# EAGLE board DAWA 6.3 (EAGLE 9.5.0)
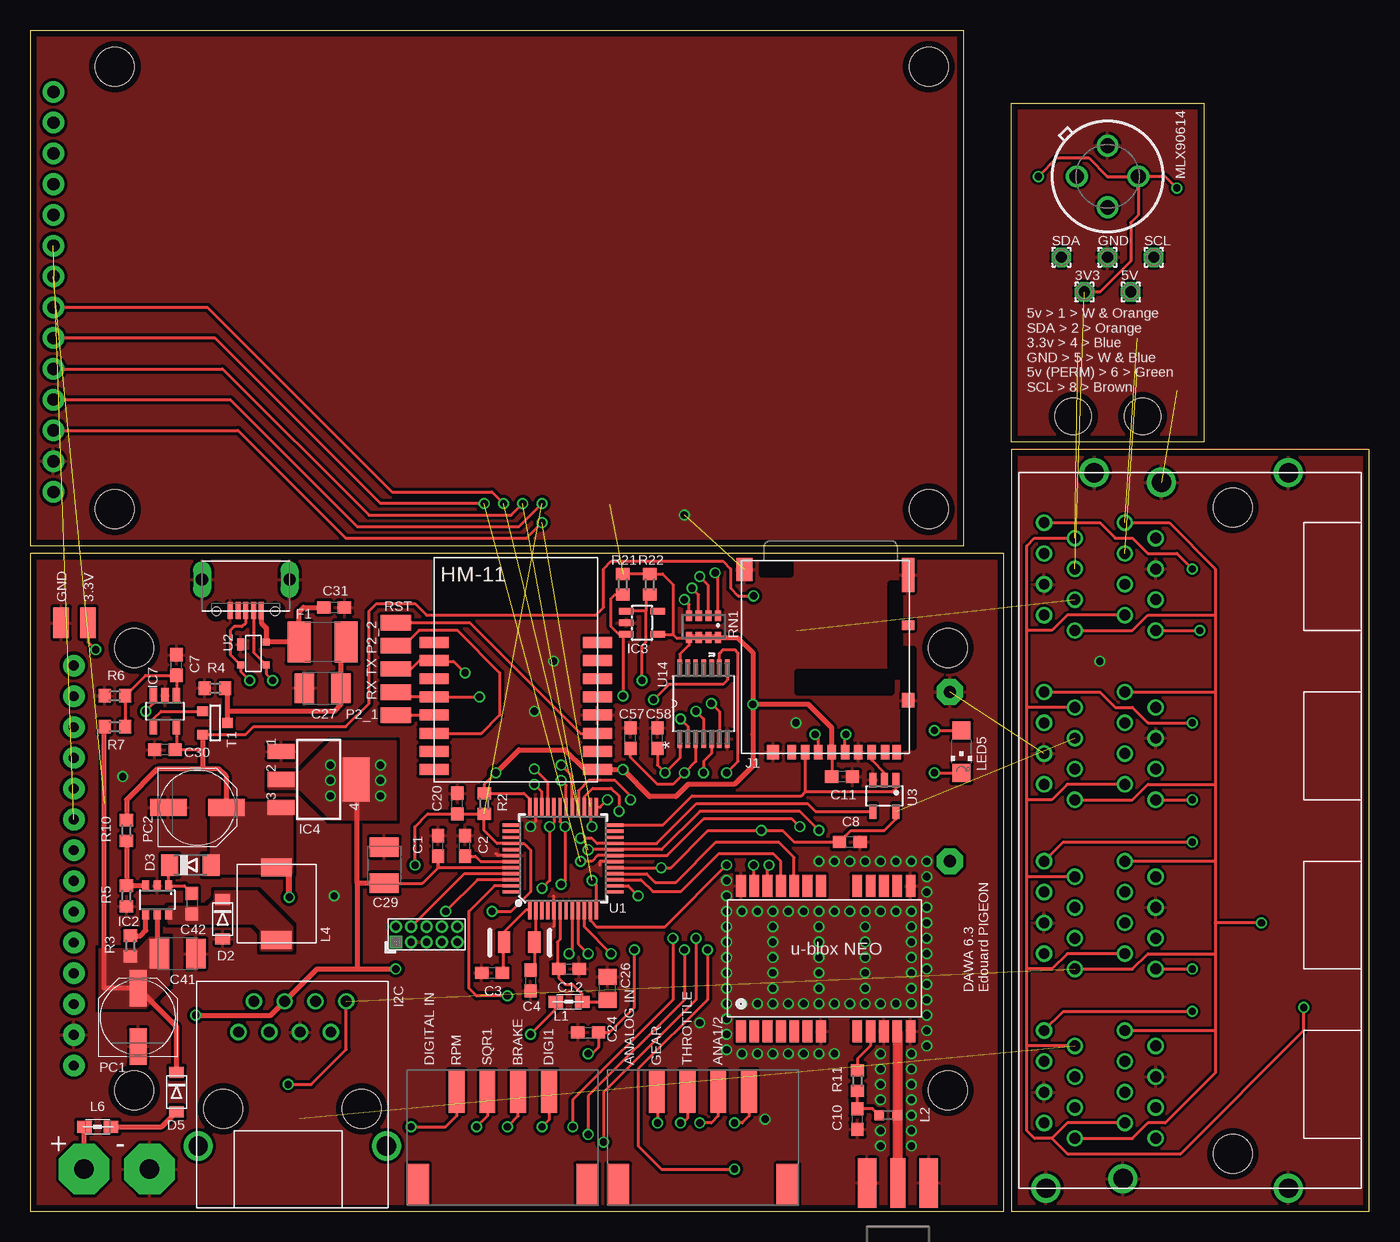
[diagram p3: board, top side]
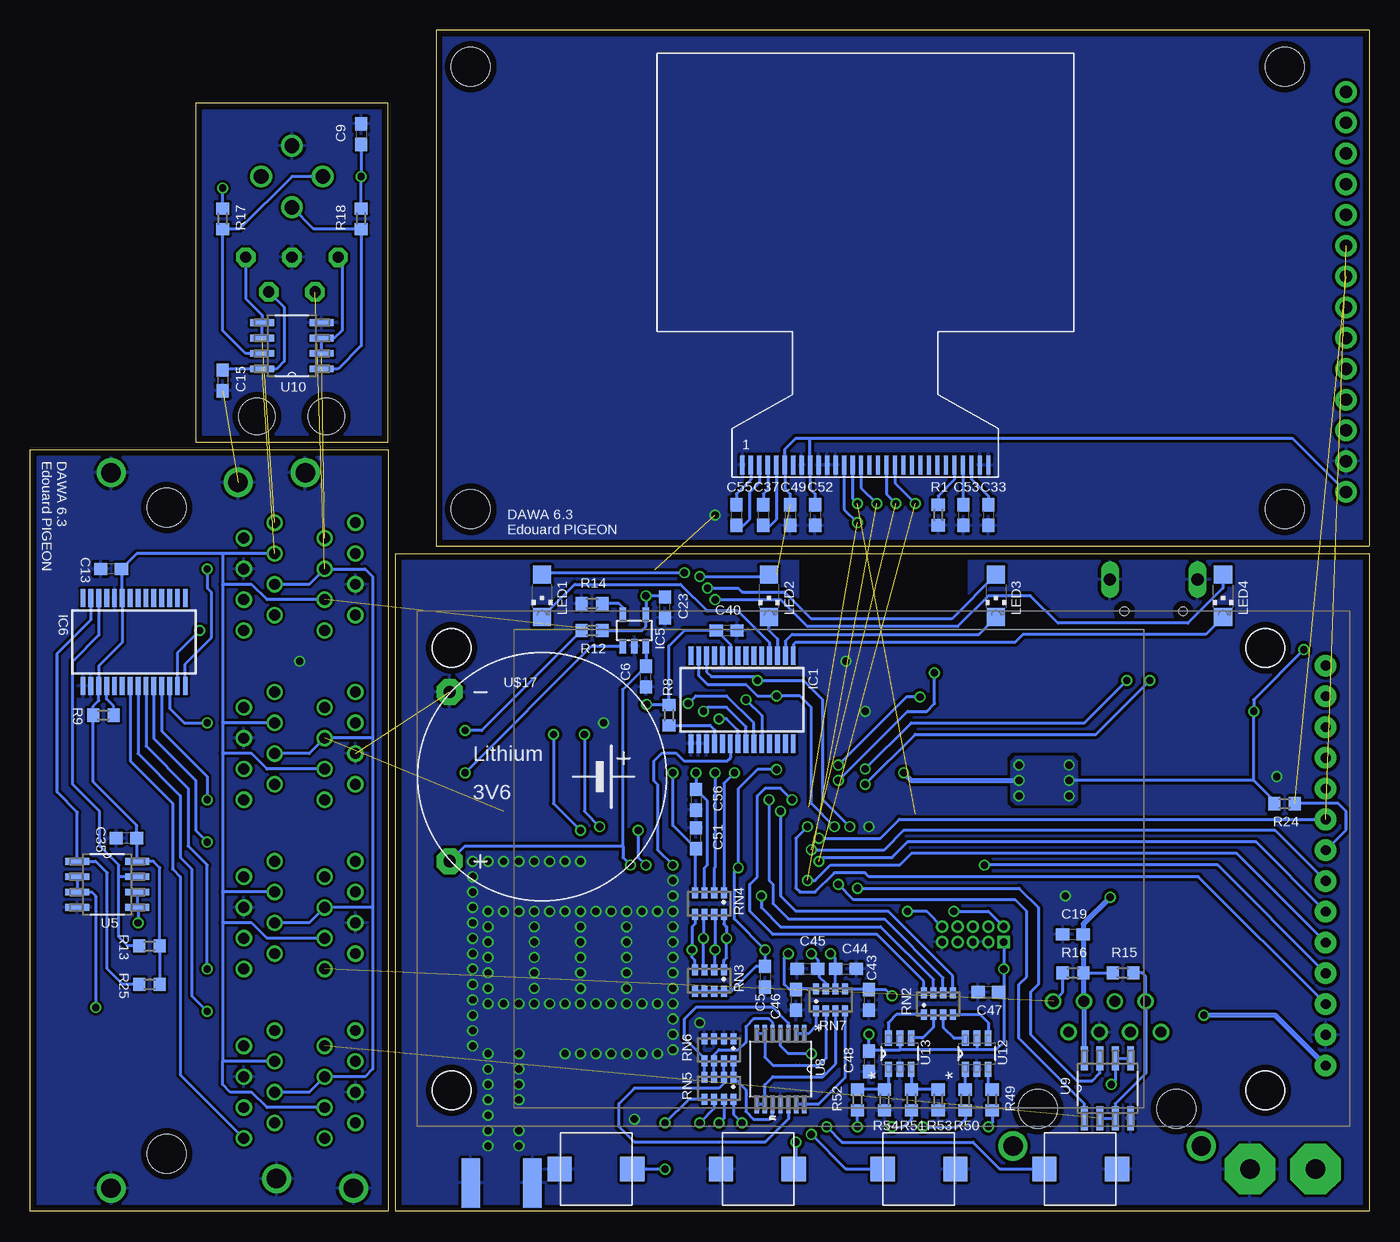
[diagram p4: board, bottom side, seen from below]

Size 110.49 x 97.47 mm. Coordinates in mm from the lower left corner, seen from the top.
Outline: 0.01,97.47 0.01,54.94
Outline: 0,97.47 76.99,97.47 76.99,54.93 0,54.93
Outline: 80.33,54.29 0.01,54.29 0.01,0.01 80.33,0.01 80.33,54.29
Outline: 80.96,91.44 96.84,91.44 96.84,63.5 80.96,63.5 80.96,91.44
Outline: 80.96,62.87 80.96,0 110.49,0 110.49,62.87 80.96,62.87
Copper layers (1*16): Top 0.035mm / dielectric 1.6mm / Bottom 0.035mm
Design rules "Elecrow_2-layer_PCB_eagle_rule *": minimum track width 6mil, minimum drill 12mil, track to track 6mil, track to pad 6mil, pad to pad 6mil, via to via 6mil, smd to smd 0mil, copper to edge 20mil, drill to drill 10mil, minimum pad ring 6mil, minimum via ring 6mil, stop-mask expansion 0mil, vias tented up to drill 100mil, thermal gap 10mil
Net classes: 0 default: width 0.203 mm, drill 0.406 mm, clearance 0.203 mm; 3 usbvcc: width 0.203 mm, drill 0.406 mm, clearance 0.203 mm; 4 USBpair: width 0.254 mm, drill 0.406 mm, clearance 0.61 mm
Holes 3 mm at 86.07,65.62 91.79,65.62
Holes 3.2 mm at 8.57,46.51 8.57,10 75.72,10 75.72,46.51 6.99,94.46 6.99,57.94 74.14,57.94 74.14,94.46

## Footprints (pad centres in the part's own frame; a part is rotated, then mirrored left to right if it is on the bottom)
SMD1,27-2,54 = smd 1.27 x 2.54: 1 0,0
4,16O1,6 = drill 1.6 pad 4.166 octagon: 1 0,0
C0603 = smd 1.1 x 1: 1 -0.85,0; 2 0.85,0
C0805 = smd 1.3 x 1.5: 1 -0.95,0; 2 0.95,0
SMC_B = smd 1.6 x 2.4: + -1.5,0; - 1.5,0
USB-MINIB-DAWA = smd 0.406 x 1.372: D+ 0,4.381; D- -0.641,4.381; GND 1.282,4.381; ID 0.641,4.381; VBUS -1.282,4.381 | drill 1 long: GND1 -3.612,1.826; GND2 3.612,1.826 | hole 0.7: -2.421,4.445; 2.421,4.445
SOD-123FL = smd 0.91 x 1.22: A 1.637,0; C -1.637,0
MINIMELF = smd 1.4 x 1.8: A 1.7,0; C -1.7,0
L1812 = smd 1.9 x 3.4: 1 -1.95,0; 2 1.95,0
SSOP28 = smd 0.4 x 1.5: 1 -4.225,-3.625; 2 -3.575,-3.625; 3 -2.925,-3.625; 4 -2.275,-3.625; 5 -1.625,-3.625; 6 -0.975,-3.625; 7 -0.325,-3.625; 8 0.325,-3.625; 9 0.975,-3.625; 10 1.625,-3.625; 11 2.275,-3.625; 12 2.925,-3.625; 13 3.575,-3.625; 14 4.225,-3.625; 15 4.225,3.625; 16 3.575,3.625; 17 2.925,3.625; 18 2.275,3.625; 19 1.625,3.625; 20 0.975,3.625; 21 0.325,3.625; 22 -0.325,3.625; 23 -0.975,3.625; 24 -1.625,3.625; 25 -2.275,3.625; 26 -2.925,3.625; 27 -3.575,3.625; 28 -4.225,3.625
SOT23-6 = smd 0.6 x 0.9: 1 -0.95,-1.15; 2 0,-1.15; 3 0.95,-1.15; 4 0.95,1.15; 5 0,1.15; 6 -0.95,1.15
SOT23-5L = smd 0.55 x 1.2: 1 -0.95,-1.3; 2 0,-1.3; 3 0.95,-1.3; 4 0.95,1.3; 5 -0.95,1.3
SOT223 = smd 1.219 x 2.235: 1 -2.311,-3.099; 2 0,-3.099; 3 2.311,-3.099 | smd 3.6 x 2.2: 4 0,3.099
SOT23-5 = smd 0.6 x 1.2: 1 -0.95,-1.306; 2 0,-1.306; 3 0.95,-1.306; 4 0.95,1.306; 5 -0.95,1.306
DM3AT-SF-PEJM5 = smd 0.7 x 1.2: 1 3.2,-0.1; 2 2.1,-0.1; 3 1,-0.1; 4 -0.1,-0.1; 5 -1.2,-0.1; 6 -2.3,-0.1; 7 -3.4,-0.1; 8 -4.5,-0.1; B -5.45,-0.1 | smd 1 x 0.8: A -6.4,-10.6 | smd 1 x 1.2: MOUNT0 4.75,-0.1; MOUNT1 -6.4,-4.4 | smd 1 x 2.8: MOUNT2 -6.4,-14.75 | smd 1.3 x 1.9: MOUNT3 7.1,-15.2
1X14-CB = drill 1.016 pad 1.778: 1 -16.51,0; 2 -13.97,0; 3 -11.43,0; 4 -8.89,0; 5 -6.35,0; 6 -3.81,0; 7 -1.27,0; 8 1.27,0; 9 3.81,0; 10 6.35,0; 11 8.89,0; 12 11.43,0; 13 13.97,0; 14 16.51,0
PINHEAD_2X05_127 = drill 0.6 pad 1.016 square: 1 -0.635,2.54 | drill 0.6 pad 1.016: 2 0.635,2.54; 3 -0.635,1.27; 4 0.635,1.27; 5 -0.635,0; 6 0.635,0; 7 -0.635,-1.27; 8 0.635,-1.27; 9 -0.635,-2.54; 10 0.635,-2.54
0805 = smd 1.2 x 1: 1 -1.1,0; 2 1.1,0
L0603 = smd 0.8 x 0.8: 1 -0.762,0; 2 0.762,0
SRR0604 = smd 1.5 x 2.5: P$1 3,0; P$2 -3,0
CHIPLED_1206 = smd 1.5 x 1.5: A 0,-1.75; C 0,1.75
TO-39 = drill 1.2: P$1 2.54,0; P$2 0,2.54; P$3 -2.54,0; P$4 0,-2.54
1,6/0,9 = drill 0.914 pad 1.6 octagon: 1 0,0
PANASONIC_D = smd 3 x 1.4: + 2.4,0; - -2.4,0
R0603 = smd 1 x 1.1: 1 -0.85,0; 2 0.85,0
RJ45 = drill 1.6: P$1 5.08,0.13; P$2 5.08,15.67 | drill 0.9: P$3 17.02,11.075; P$4 17.02,3.455; P$5 17.02,5.995; P$6 14.48,4.725; P$7 14.48,7.265; P$8 14.48,12.345; P$9 14.48,9.805; P$10 17.02,8.535 | hole 3.2: 8.14,2.185; 8.14,13.615
742-8NS = smd 0.5 x 0.9: 1 -1.2,-0.9; 2 -0.4,-0.9; 3 0.4,-0.9; 4 1.2,-0.9; 5 1.2,0.9; 6 0.4,0.9; 7 -0.4,0.9; 8 -1.2,0.9
SOT-23 = smd 0.787 x 0.889: 1 0.025,-1.016; 2 -0.94,1.016; 3 0.991,1.016
TQFP-48 = smd 1.5 x 0.28: 1 -4.25,2.75; 2 -4.25,2.25; 3 -4.25,1.75; 4 -4.25,1.25; 5 -4.25,0.75; 6 -4.25,0.25; 7 -4.25,-0.25; 8 -4.25,-0.75; 9 -4.25,-1.25; 10 -4.25,-1.75; 11 -4.25,-2.25; 12 -4.25,-2.75; 25 4.25,-2.75; 26 4.25,-2.25; 27 4.25,-1.75; 28 4.25,-1.25; 29 4.25,-0.75; 30 4.25,-0.25; 31 4.25,0.25; 32 4.25,0.75; 33 4.25,1.25; 34 4.25,1.75; 35 4.25,2.25; 36 4.25,2.75 | smd 0.28 x 1.5: 13 -2.75,-4.25; 14 -2.25,-4.25; 15 -1.75,-4.25; 16 -1.25,-4.25; 17 -0.75,-4.25; 18 -0.25,-4.25; 19 0.25,-4.25; 20 0.75,-4.25; 21 1.25,-4.25; 22 1.75,-4.25; 23 2.25,-4.25; 24 2.75,-4.25; 37 2.75,4.25; 38 2.25,4.25; 39 1.75,4.25; 40 1.25,4.25; 41 0.75,4.25; 42 0.25,4.25; 43 -0.25,4.25; 44 -0.75,4.25; 45 -1.25,4.25; 46 -1.75,4.25; 47 -2.25,4.25; 48 -2.75,4.25
SOT-143B = smd 1 x 0.6: 1 -0.75,-1.05 | smd 0.6 x 0.6: 2 0.95,-1.05; 3 0.95,1.05; 4 -0.95,1.05
SOT23-5' = smd 0.55 x 1.2: 1 -0.95,-1.3; 2 0,-1.3; 3 0.95,-1.3; 4 0.95,1.3; 5 -0.95,1.3
SOIC127P600X175-8N = smd 1.981 x 0.559: 1 -2.464,1.905; 2 -2.464,0.635; 3 -2.464,-0.635; 4 -2.464,-1.905; 5 2.464,-1.905; 6 2.464,-0.635; 7 2.464,0.635; 8 2.464,1.905
SOP65P640X120-14N = smd 1.473 x 0.356: 1 -2.921,1.956; 2 -2.921,1.295; 3 -2.921,0.66; 4 -2.921,0; 5 -2.921,-0.66; 6 -2.921,-1.295; 7 -2.921,-1.956; 8 2.921,-1.956; 9 2.921,-1.295; 10 2.921,-0.66; 11 2.921,0; 12 2.921,0.66; 13 2.921,1.295; 14 2.921,1.956
SOT95P280X145-6N = smd 1.27 x 0.559: 1 -1.295,0.94; 2 -1.295,0; 3 -1.295,-0.94; 4 1.295,-0.94; 5 1.295,0; 6 1.295,0.94
OSCILLATOR_SMD = smd 1 x 1.8: 1 0,0; 2 2.5,0
HM-11 = smd 2.4 x 0.9: GND 6.5,0; NC@5 -7,0; NC@6 -7,-1.5; NC@7 -7,-3; NC@8 -7,-4.5; NC@10 6.5,-3; PIO0 6.5,6; PIO1 6.5,4.5; PIO2 6.5,3; PIO3 6.5,1.5; RESETB 6.5,-1.5; UART_CTS -7,3; UART_RTS -7,6; UART_RX -7,1.5; UART_TX -7,4.5; VCC 6.5,-4.5
NEO-M8 = smd 1.8 x 0.8: 1 6.4,-7.4; 2 6.4,-6.3; 3 6.4,-5.2; 4 6.4,-4.1; 5 6.4,-3; 6 6.4,-1.9; 7 6.4,-0.8; 8 6.4,2.2; 9 6.4,3.3; 10 6.4,4.4; 11 6.4,5.5; 12 6.4,6.6; 13 -5.6,6.6; 14 -5.6,5.5; 15 -5.6,4.4; 16 -5.6,3.3; 17 -5.6,2.2; 18 -5.6,-0.8; 19 -5.6,-1.9; 20 -5.6,-3; 21 -5.6,-4.1; 22 -5.6,-5.2; 23 -5.6,-6.3; 24 -5.6,-7.4
TFT_2.4 = drill 0.8 pad 1.778: TFT_CS -32.42,2; TFT_DC -27.34,2; TFT_GND -34.96,2; TFT_LED -19.72,2; TFT_RESET -29.88,2; TFT_SCK -22.26,2; TFT_SDI(MOSI) -24.8,2; TFT_SDO(MISO) -17.18,2; TFT_T_CLK -14.64,2; TFT_T_CS -12.1,2; TFT_T_DIN -9.56,2; TFT_T_DO -7.02,2; TFT_T_IRQ -4.48,2; TFT_VCC -37.5,2
SKPMAPE10 = smd 2 x 2: P$1 -3,0; P$2 3,0
4_PIN_JST-XH-SMD = smd 1.3 x 3.5: 1 6.604,-0.254; 2 4.064,-0.254; 3 1.524,-0.254; 4 -1.016,-0.254 | smd 1.8 x 3.4: P$1 9.779,-7.938; P$2 -4.191,-7.938
1X30-0.7MM = smd 0.35 x 1.6: 1 -10.15,0; 2 -9.45,0; 3 -8.75,0; 4 -8.05,0; 5 -7.35,0; 6 -6.65,0; 7 -5.95,0; 8 -5.25,0; 9 -4.55,0; 10 -3.85,0; 11 -3.15,0; 12 -2.45,0; 13 -1.75,0; 14 -1.05,0; 15 -0.35,0; 16 0.35,0; 17 1.05,0; 18 1.75,0; 19 2.45,0; 20 3.15,0; 21 3.85,0; 22 4.55,0; 23 5.25,0; 24 5.95,0; 25 6.65,0; 26 7.35,0; 27 8.05,0; 28 8.75,0; 29 9.45,0; 30 10.15,0
LI_3.6 = drill 1.016 pad 2.159 octagon: + -7.62,-6.985; - -7.62,6.985
RJ45X8 = drill 0.9: P$1 13.018,22.701; P$2 11.748,20.161; P$3 10.477,22.701; P$4 9.207,20.161; P$5 7.938,22.701; P$6 6.668,20.161; P$7 5.397,22.701; P$8 4.128,20.161; P$9 26.988,22.701; P$10 25.718,20.161; P$11 24.448,22.701; P$12 23.177,20.161; P$13 21.907,22.701; P$14 20.637,20.161; P$15 19.367,22.701; P$16 18.098,20.161; P$17 40.958,22.701; P$18 39.688,20.161; P$19 38.417,22.701; P$20 37.148,20.161; P$21 35.877,22.701; P$22 34.608,20.161; P$23 33.337,22.701; P$24 32.068,20.161; P$25 54.928,22.701; P$26 53.657,20.161; P$27 52.388,22.701; P$28 51.117,20.161; P$29 49.847,22.701; P$30 48.578,20.161; P$31 47.307,22.701; P$32 46.038,20.161; P$33 4.128,13.494; P$34 5.397,16.034; P$35 6.668,13.494; P$36 7.938,16.034; P$37 9.207,13.494; P$38 10.477,16.034; P$39 11.748,13.494; P$40 13.018,16.034; P$41 18.098,13.494; P$42 19.367,16.034; P$43 20.637,13.494; P$44 21.907,16.034; P$45 23.177,13.494; P$46 24.448,16.034; P$47 25.718,13.494; P$48 26.988,16.034; P$49 32.068,13.494; P$50 33.337,16.034; P$51 34.608,13.494; P$52 35.877,16.034; P$53 37.148,13.494; P$54 38.417,16.034; P$55 39.688,13.494; P$56 40.958,16.034; P$57 46.038,13.494; P$58 47.307,16.034; P$59 48.578,13.494; P$60 49.847,16.034; P$61 51.117,13.494; P$62 52.388,16.034; P$63 53.657,13.494; P$64 54.928,16.034 | drill 1.6: P$67 0,22.543; P$68 0.794,16.192; P$69 0,2.54; P$70 59.055,2.54; P$71 58.261,13.018; P$72 59.055,18.574 | hole 3.2: 2.857,7.144; 56.197,7.144
SMA_EDGELAUNCH = smd 4.064 x 1.524: GND@1 2.032,-2.54; GND@2 2.032,2.54 | smd 4.064 x 1.524 bottom: GND@3 2.032,2.54; GND@4 2.032,-2.54 | smd 4.064 x 1.27: P 2.032,0

## Placement (x,y rotation side)
3.3V  WIREPADSMD1,27-254  [SMD1,27-2,54]  4.76,48.58 180 top
+  WIREPAD4,16O1,6  [4,16O1,6]  4.45,3.49 0 top
-  WIREPAD4,16O1,6  [4,16O1,6]  9.84,3.49 0 top
C1  100nF  [C0603]  33.66,30.16 90 top
C2  100nF  [C0603]  35.88,30.16 90 top
C3  22pF  [C0603]  38.1,19.68 180 top
C4  22pF  [C0603]  41.27,19.05 270 top
C5  100nF  [C0603]  49.85,19.37 270 bottom
C6  4.7µF  [C0603]  59.69,44.13 90 bottom
C7  100nF  [C0603]  12.06,45.09 90 top
C8  4.7µF  [C0603]  67.63,30.48 180 top
C9  100nF  [C0603]  83.19,88.9 270 bottom
C10  47pF  [C0603]  68.26,7.62 90 top
C11  100nF  [C0603]  66.99,35.88 180 top
C12  100nF  [C0603]  44.45,20 0 top
C13  100nF  [C0603]  103.82,53.02 180 bottom
C15  100nF  [C0603]  94.61,68.58 270 bottom
C19  100nF  [C0603]  24.45,22.86 180 bottom
C20  100nF  [C0603]  35.24,33.66 90 top
C23  4.7µF  [C0603]  58.1,49.85 90 bottom
C24  100nF  [C0603]  46.04,14.76 0 top
C26  10µF  [C0805]  47.62,18.41 90 top
C27  10µF  [SMC_B]  24.13,43.18 180 top
C29  10µF  [SMC_B]  29.21,28.57 90 top
C30  100nF  [C0603]  11.11,38.1 180 top
C31  10nF  [C0603]  25.08,49.85 0 top
C33  2.2µF  [C0603]  31.43,57.47 270 bottom
C35  100nF  [C0603]  102.55,30.8 180 bottom
C37  2.2µF  [C0603]  50.01,57.47 270 bottom
C40  100nF  [C0603]  53.02,47.94 0 bottom
C41  10µF  [SMC_B]  12.15,21.27 0 top
C42  10nF  [C0603]  13.34,25.4 270 top
C43  470pF  [C0603]  41.27,17.46 270 bottom
C44  470pF  [C0603]  43.18,20 0 bottom
C45  470pF  [C0603]  46.35,20 180 bottom
C46  470pF  [C0603]  47.31,17.46 270 bottom
C47  100nF  [C0603]  31.43,18.1 180 bottom
C48  100nF  [C0603]  41.27,12.38 270 bottom
C49  2.2µF  [C0603]  47.78,57.47 270 bottom
C51  100nF  [C0603]  55.56,30.8 90 bottom
C52  2.2µF  [C0603]  45.72,57.47 270 bottom
C53  2.2µF  [C0603]  33.5,57.47 270 bottom
C55  2.2µF  [C0603]  52.23,57.47 270 bottom
C56  100nF  [C0603]  55.56,33.97 270 bottom
C57  100nF  [C0603]  49.53,39.05 90 top
C58  100nF  [C0603]  51.75,39.05 90 top
CN2  [USB-MINIB-DAWA]  17.78,53.98 180 top
D2  MBR120  [SOD-123FL]  15.88,24.13 270 top
D3  CD1206-S01575  [MINIMELF]  13.22,28.57 0 top
D5  MBR120  [SOD-123FL]  12.06,9.84 270 top
F1  MF-MSMF050-2 500mA  [L1812]  24.13,46.99 180 top
GND  WIREPADSMD1,27-254  [SMD1,27-2,54]  2.54,48.58 0 top
IC1  MCP23017SS  [SSOP28]  51.75,42.23 180 bottom
IC2  LM2734Y  [SOT23-6]  10.48,25.72 180 top
IC3  24AA02E48  [SOT23-5L]  50.48,48.58 270 top
IC4  NCP1117ST33T3G-3V3  [SOT223]  23.79,35.65 270 top
IC5  MCP73831/OT  [SOT23-5L]  60.64,47.94 0 bottom
IC6  MCP23017SS  [SSOP28]  101.92,46.99 180 bottom
IC7  LMV321M5  [SOT23-5]  11.11,41.27 180 top
J1  DM3AT-SF-PEJM5  [DM3AT-SF-PEJM5]  66.04,37.78 180 top
JP2  [1X14-CB]  1.91,75.88 90 top
JTAG  [PINHEAD_2X05_127]  32.7,22.86 90 top
L1  MH2029-300Y  [0805]  44.45,17.3 0 top
L2  27nH  [L0603]  70.8,7.94 0 top
L4  10u SRR0604-100ML  [SRR0604]  20.32,25.4 270 top
L6  MH2029-300Y  [0805]  5.56,6.99 180 top
LED1  [CHIPLED_1206]  68.26,50.8 180 bottom
LED2  [CHIPLED_1206]  49.53,50.8 180 bottom
LED3  [CHIPLED_1206]  30.8,50.8 180 bottom
LED4  [CHIPLED_1206]  12.06,50.8 180 bottom
LED5  [CHIPLED_1206]  76.83,37.94 180 top
MLX90614  MLX90614  [TO-39]  88.9,85.41 180 top
P2_1  [SMD1,27-2,54]  30.16,40.96 90 top
P2_2  WIREPADSMD1,27-254  [SMD1,27-2,54]  30.16,46.67 90 top
PAD6  [1,6/0,9]  92.71,78.74 0 top
PAD7  [1,6/0,9]  90.81,75.88 0 top
PAD8  [1,6/0,9]  88.9,78.74 0 top
PAD9  [1,6/0,9]  87,75.88 0 top
PAD10  [1,6/0,9]  85.09,78.74 0 top
PC1  47µF  [PANASONIC_D]  8.89,16.02 90 top
PC2  47µF  [PANASONIC_D]  13.79,33.34 0 top
R1  390k  [R0603]  35.56,57.47 90 bottom
R2  10k  [R0603]  37.47,33.66 90 top
R3  10k  [R0603]  8.26,21.91 90 top
R4  10k  [R0603]  15.24,43.18 0 top
R5  10k  [R0603]  7.94,26.04 90 top
R6  100k  [R0603]  6.99,42.55 180 top
R7  100k  [R0603]  6.99,40.01 0 top
R8  10k  [R0603]  57.78,40.96 90 bottom
R9  10k  [R0603]  104.46,40.96 180 bottom
R10  52k3  [R0603]  7.94,31.43 90 top
R11  10  [R0603]  68.26,10.79 270 top
R12  330  [R0603]  64.14,47.94 0 bottom
R13  4.7k  [R0603]  100.65,21.91 180 bottom
R14  27k  [R0603]  64.14,50.16 180 bottom
R15  1k  [R0603]  20.32,19.68 0 bottom
R16  1k  [R0603]  24.45,19.68 180 bottom
R17  4.7k  [R0603]  94.61,81.92 270 bottom
R18  4.7k  [R0603]  83.19,81.92 270 bottom
R21  4.7k  [R0603]  48.9,51.75 270 top
R22  4.7k  [R0603]  51.12,51.75 270 top
R24  330  [R0603]  6.99,33.66 180 bottom
R25  4.7k  [R0603]  100.65,18.73 180 bottom
R49  4.7k  [R0603]  31.11,9.21 90 bottom
R50  4.7k  [R0603]  33.34,9.21 90 bottom
R51  1.8k  [R0603]  37.78,9.21 90 bottom
R52  1.8k  [R0603]  42.23,9.21 90 bottom
R53  1k  [R0603]  35.56,9.21 90 bottom
R54  1k  [R0603]  40.01,9.21 90 bottom
RJ45_MAIN_BOARD  RJ45  [RJ45]  29.53,0.32 90 top
RN1  100  [742-8NS]  55.56,48.26 180 top
RN2  510  [742-8NS]  35.56,17.14 0 bottom
RN3  10k  [742-8NS]  54.45,19.05 180 bottom
RN4  10k  [742-8NS]  54.45,25.4 180 bottom
RN5  4.7k  [742-8NS]  53.66,10.16 180 bottom
RN6  9.1k  [742-8NS]  53.66,13.34 180 bottom
RN7  510  [742-8NS]  44.45,17.46 0 bottom
RST  WIREPADSMD1,27-254  [SMD1,27-2,54]  30.16,48.58 90 top
RX  [SMD1,27-2,54]  30.16,42.86 90 top
T1  FDN340P  [SOT-23]  15.25,40.28 90 top
TX  [SMD1,27-2,54]  30.16,44.77 90 top
U1  ATSAMD21G-A  [TQFP-48]  43.96,29.12 90 top
U2  PRTR5V0U2X  [SOT-143B]  18.41,46.04 270 top
U3  74AHC1G125  [SOT23-5']  70.48,34.29 180 top
U5  P82B96D  [SOIC127P600X175-8N]  104.14,26.99 0 bottom
U8  TLV2374  [SOP65P640X120-14N]  48.58,11.75 270 bottom
U9  P82B96D  [SOIC127P600X175-8N]  21.59,10.16 90 bottom
U10  P82B96D  [SOIC127P600X175-8N]  88.9,71.44 180 bottom
U12  SN74LVC2G17DBVR  [SOT95P280X145-6N]  32.38,13.02 90 bottom
U13  SN74LVC2G17DBVR  [SOT95P280X145-6N]  38.73,13.02 90 bottom
U14  CD40106BPW  [SOP65P640X120-14N]  55.56,41.91 90 top
U$1  OSCILLATOR_32KHZ  [OSCILLATOR_SMD]  41.59,22.23 180 top
U$2  HM-11  [HM-11]  40.32,40.96 0 top
U$3  NEO-M8  [NEO-M8]  66.04,21.27 270 top
U$4  TFT_2.4  [TFT_2.4]  1.59,49.53 90 bottom
U$5  SKPMAPE10  [SKPMAPE10]  63.82,3.49 0 bottom
U$6  SKPMAPE10  [SKPMAPE10]  50.48,3.49 0 bottom
U$7  SKPMAPE10  [SKPMAPE10]  37.15,3.49 180 bottom
U$8  SKPMAPE10  [SKPMAPE10]  23.81,3.49 180 bottom
U$9  4_PIN_JST-XH-SMD  [4_PIN_JST-XH-SMD]  36.2,10.16 0 top
U$15  4_PIN_JST-XH-SMD  [4_PIN_JST-XH-SMD]  52.7,10.16 0 top
U$16  UG-2864HSWEG01  [1X30-0.7MM]  41.58,61.59 0 bottom
U$17  LI_3.6  [LI_3.6]  68.26,35.88 0 bottom
U$18  RJ45X8  [RJ45X8]  106.36,1.91 90 top
X1  [SMA_EDGELAUNCH]  71.6,0.32 90 top

## Tracks (layer width: path | path; a pad name or v marks a point on that pad's centre or on a via)
+3V3  (via drill 0.6)  (3 unrouted)
  Top 0.254: J1.4 C11.2 | v49.85,21.59 49.85,16.83 47.78,14.76 C24.2 46.89,13.55 46.35,13.02 v46.04,13.02 | U1.17 v52.07,28.37 52.87,28.37 55.94,31.43 v60.33,31.43 62.09,31.43 63.04,30.48 C8.2 67.73,31.43 70.48,31.43 71.44,32.38 U3.5 | v9.53,41.27 10.16,41.91 IC7.3 | U1.44 33.66,28.37 C1.1 33.66,28.36 32.37,27.07 C29.+ | U1.36 41.21,34.03 40.74,34.51 R2.2 37.47,35.24 v38.42,36.2 | MLX90614.P$3 91.44,82.23 90.81,81.6 90.81,78.42 88.27,75.88 PAD9.1 | MLX90614.P$3 88.9,85.41 87.35,86.95 84.73,86.95 v83.19,85.41 | v94.61,84.45 93.66,85.41 MLX90614.P$3 | U$3.23 59.74,28.52 v59.69,28.57 | v41.27,14.61 43.35,16.68 L1.1 | R21.1 R22.1 52.17,52.6 53.02,51.75 53.02,47.62 | 59.62,39.16 59.62,39.37 | U14.14 53.61,45.99 54.36,46.74 RN1.5 54.31,47.31 53.34,47.31 53.02,47.62 | 3.3V.1 4.76,46.99 v5.4,46.35 | IC3.4 53.02,47.62
  Top 0.406: C29.+ 26.99,27.07 | 26.99,27.07 26.99,35.55 IC4.4 | v38.42,36.2 40.32,38.1 44.13,38.1 45.77,36.46 U$2.VCC v48.9,36.46 51.12,34.23 53.28,34.23 54.29,35.24 58.1,35.24 59.62,36.76 59.62,39.37 v59.62,41.84 | v59.62,41.84 64.2,41.84 66.14,39.91 J1.4 | v13.65,16.19 19.85,16.19 RJ45_MAIN_BOARD.P$10 23.66,20 26.99,20 | 26.99,20 v30.16,20 | 26.99,27.07 26.99,20 | v59.62,41.84 59.62,46.11 58.37,47.36 RN1.8
  Top 0.508: RN1.8 RN1.7 RN1.6 RN1.5
  Bottom 0.254: 38.73,13.34 41.17,13.34 C48.1 v41.27,14.61 | 32.38,13.34 38.73,13.34 | U13.5 38.73,13.34 | U12.5 32.38,13.34 | U8.4 48.58,13.65 47.94,13.02 v46.04,13.02 | R18.1 v83.19,85.41 C9.2 | R17.1 v94.61,84.45 | v48.9,36.46 50.48,36.46 52.07,34.87 v52.07,28.37 52.39,28.05 52.39,24.13 v49.85,21.59 C5.1 50.59,20.22 52.65,18.15 RN3.8 RN3.7 RN3.6 RN3.5 | 9.53,35.56 v9.53,41.27 9.53,42.23 v5.4,46.35 | 9.53,35.56 v24.77,35.56 | IC1.9 52.73,46.8 C40.1 56.52,47.94 57.78,46.67 R8.2 57.82,41.84 v59.62,41.84 | v60.33,31.43 60.33,29.21 v59.69,28.57 | R24.2 7.83,33.87 9.53,35.56 | C49.1 47.78,59.21 48.23,59.66 U$16.6 48.23,62.89 47.31,63.82 46.13,63.82 | C52.1 45.72,59.21 46.13,59.63 U$16.9 46.13,63.82 | JP2.1 6.35,63.82 46.13,63.82 | JTAG.1 v30.16,20 30.16,18.1 | 30.16,18.1 30.16,13.97 30.8,13.34 32.38,13.34 | C47.1 30.16,18.1 | U$18.P$60 87.47,51.75 U$18.P$28 82.87,53.02 82.23,52.39 82.23,39.05 | 82.23,39.05 82.23,25.08 | 82.23,25.08 82.23,11.75 82.87,11.11 U$18.P$4 87.47,9.84 U$18.P$36 | 82.23,25.08 U$18.P$12 87.47,23.81 U$18.P$44 | 82.23,39.05 U$18.P$20 87.47,37.78 U$18.P$52
  Bottom 0.406: v38.42,36.2 37.78,35.56 v28.89,35.56 | U$4.TFT_VCC 7.75,16.19 v13.65,16.19
  other vias: 24.77,36.83 24.77,34.29 28.89,34.29 28.89,36.83
  pour Top (no thermals): 19.68,36.2 19.68,34.92 22.23,34.92 24.77,32.38 30.16,32.38 30.16,38.73 24.77,38.73 22.23,36.2
  pour Bottom (no thermals): 24.45,37.47 29.21,37.47 29.53,37.15 29.53,33.97 29.21,33.66 24.45,33.66 24.13,33.97 24.13,37.15
+5V  (via drill 0.6)  (2 unrouted)
  Top 0.254: IC7.5 12.06,38.2 | 14.23,38.1 C30.1 | v59.69,50.8 58.42,50.8 57.78,51.44 57.78,53.02 57.15,53.66 47.94,53.66 47.31,53.02 47.31,49.85 46.67,49.21 32.7,49.21 31.75,50.16 28.57,50.16 27.94,49.53 27.94,41.91 26.04,40.01 18.41,40.01 17.75,39.34 T1.2
  Top 0.406: PC2.+ 16.19,35.88 15.56,36.51 14.29,36.51 | 14.29,36.51 10.48,36.51 7.94,33.97 R10.2 | T1.2 14.23,38.1 14.23,36.57 14.29,36.51
  Top 0.508: 12.06,38.2 C30.1 | v21.38,25.93 21.38,28.4 L4.P$2
  Bottom 0.254: R16.1 R15.1 | C15.1 94.51,69.53 U10.8 90.17,69.53 89.53,70.17 89.53,74.61 PAD7.1 | R25.1 R13.1 99.8,28.36 100.33,28.89 U5.8 101.68,30.77 C35.1 101.7,31.85 105.31,35.46 R9.2 105.31,41.7 104.84,42.16 IC6.17 104.84,45.02 102.89,46.97 IC6.9 102.89,52.94 C13.1 101.7,54.29 94.61,54.29 | R12.2 60.01,47.94 59.69,48.26 IC5.4 v59.69,50.8 58.2,50.8 C23.2 | U$18.P$62 94.61,54.29 | 94.61,54.29 94.61,51.75 | 94.61,51.75 94.61,40.32 | 94.61,40.32 94.61,37.78 | 94.61,37.78 94.61,26.35 | 94.61,26.35 94.61,23.81 | 94.61,23.81 94.61,12.38 | U$18.P$6 90.96,8.57 92.23,9.84 93.98,9.84 94.61,10.48 94.61,12.38 | U$18.P$38 94.61,12.38 | U$18.P$14 90.96,22.54 92.23,23.81 94.61,23.81 | U$18.P$46 94.61,26.35 | U$18.P$22 90.96,36.51 92.23,37.78 94.61,37.78 | U$18.P$54 94.61,40.32 | U$18.P$30 90.96,50.48 92.23,51.75 94.61,51.75
  Bottom 0.406: v21.38,25.93 23.6,23.71 C19.1 R16.1 23.6,17.4 RJ45_MAIN_BOARD.P$5 23.5,17.3 U9.8
  pour Top (no thermals): 21.59,27.94 21.59,33.66 14.92,33.66 14.92,27.94
A2  (via drill 0.6)
  Top 0.254: U1.8 44.71,21.54 v44.45,21.27
  Bottom 0.254: RN7.6 44.05,19.98 | 44.05,19.98 C44.1 | 44.05,19.98 44.05,20.87 v44.45,21.27
A3  (via drill 0.6)
  Top 0.254: U1.9 45.21,22.1 v46.04,21.27
  Bottom 0.254: RN7.7 44.85,18.82 45.4,19.37 45.4,19.9 C45.1 45.51,20.74 v46.04,21.27
A4  (via drill 0.6)
  Top 0.254: U1.10 45.71,23.5 v47.94,21.27
  Bottom 0.254: RN7.8 47.26,18.36 C46.1 47.84,18.31 48.26,18.73 48.26,20.95 v47.94,21.27
A5  (via drill 0.6)
  Top 0.254: U1.47 38.3,26.87 36.2,24.77 36.2,18.41 36.83,17.78 v39.37,17.78
  Bottom 0.254: RN7.5 43.2,18.31 C43.1 39.9,18.31 v39.37,17.78
ALIM+
  Top 0.406: +.1 4.45,6.97 L6.2
ANA1_IN  (via drill 0.6)
  Top 0.254: U$15.2 56.77,7.87 56.2,7.3 v55.24,7.3
  Bottom 0.254: RN5.6 54.06,8.49 v55.24,7.3
ANA2_IN  (via drill 0.6)
  Top 0.254: v58.1,7.3 58.74,7.3 59.31,7.87 U$15.1
  Bottom 0.254: v58.1,7.3 56.15,9.26 RN5.5
BOOST
  Top 0.254: D3.C 11.43,28.48 IC2.1 12.72,26.87 C42.1
BRAKE_IN  (via drill 0.6)
  Top 0.254: v39.37,6.99 40.26,7.87 U$9.2
  Bottom 0.254: v39.37,6.99 38.42,6.99 37.78,7.62 R51.1
CMP
  Top 0.254: C7.1 9.52,44.23 R6.1 R7.2 | C7.1 IC7.1
  Top 0.508: C7.1
D3  (via drill 0.6)
  Top 0.254: U1.14 49.33,26.87 v50.16,26.04
  Bottom 0.254: RN2.7 35.96,19.13 40.32,23.5 48.58,23.5 50.16,25.08 v50.16,26.04
D5
  Top 0.254: U1.24 52.19,31.87 54.61,34.29 63.62,34.29 63.94,34.61 | J1.2 63.94,34.61 | U3.1 71.44,34.92 71.12,34.61 63.94,34.61
D6  (via drill 0.6)
  Top 0.254: U1.29 44.71,35.93 v43.81,36.83 | v37.07,42.46 v37.06,42.46 U$2.UART_RX 30.57,42.46 RX.1
  Bottom 0.254: v37.07,42.46 38.18,42.46 v43.81,36.83
D7  (via drill 0.6)
  Top 0.254: TX.1 31.43,44.77 32.12,45.46 U$2.UART_TX 33.38,45.4 34.92,45.4 v35.88,44.45 | U1.30 44.21,35.16 v43.81,35.56
  Bottom 0.254: v43.81,35.56 38.1,41.27 36.51,41.27 35.88,41.91 v35.88,44.45
D10  (via drill 0.6)
  Top 0.254: U1.27 45.74,33.4 45.74,34.25 46.41,34.92 47.94,34.92 48.58,34.29 v48.58,33.02
  Bottom 0.254: v48.58,33.02 48.58,26.04 47.31,24.77 39.69,24.77 34.36,19.44 RN2.5
D12  (via drill 0.6)
  Top 0.254: U1.28 45.24,33.4 45.24,34.72 46.08,35.56 48.26,35.56 49.53,34.29 v49.53,33.97
  Bottom 0.254: RN2.6 35.16,19.29 40.01,24.13 47.94,24.13 49.21,25.4 49.21,26.99 49.53,27.3 v49.53,33.97
DIGI1_OPT  (via drill 0.6)
  Top 0.254: U1.25 47.02,33.37 v47.62,33.97
  Bottom 0.254: RN2.8 36.76,18.98 40.64,22.86 49.21,22.86 51.12,24.77 51.12,26.99 50.48,27.62 50.48,34.29 49.85,34.92 48.58,34.92 v47.62,33.97
DIGI1_OPT_IN  (via drill 0.6)
  Top 0.254: U$9.1 42.8,7.56 v42.23,6.99
  Bottom 0.254: v42.23,6.99 R52.1
EN
  Top 0.406: R3.2 9.11,22.76 9.53,23.18 IC2.4
FB
  Top 0.406: R10.1 R5.2 9.51,26.89
  Top 0.508: IC2.3 9.51,26.89
GATE_CMD
  Top 0.254: IC7.4 10.16,40.64 10.79,41.27 T1.3
GEAR_IN  (via drill 0.6)
  Top 0.254: U$15.4 51.69,9.84 51.75,9.84 v51.75,7.3
  Bottom 0.254: RN5.8 52.46,8.01 v51.75,7.3
GND  (via drill 0.6)  (3 unrouted)
  Top 0.254: U1.35 41.71,32.19 v41.27,31.75 | 43.18,26.04 43.21,26 U1.5 43.21,23.53 43.18,23.5 | U1.18 46.99,28.87 46.99,28.57 | U1.42 38.58,29.37 38.42,29.53
  other vias: 72.71,17.14 72.71,18.41 72.71,19.68 72.71,20.95 72.71,22.23 72.71,23.5 72.71,24.77 71.44,24.77 70.17,24.77 68.9,24.77 67.63,24.77 66.36,24.77 71.44,17.14 70.17,17.14 68.9,17.14 67.63,17.14 66.36,17.14 65.09,17.14 63.82,17.14 62.55,17.14 65.09,24.77 63.82,24.77 62.55,24.77 61.28,24.77 68.9,18.41 65.09,18.41 61.28,19.68 61.28,20.95 61.28,22.23 61.28,23.5 65.09,19.68 65.09,20.95 65.09,22.23 65.09,23.5 68.9,19.68 68.9,20.95 68.9,22.23 68.9,23.5 61.28,18.41 61.28,17.14 60.01,17.14 58.74,17.14 60.01,24.77 58.74,24.77 57.47,24.77 57.47,19.68 57.47,20.95 57.47,22.23 57.47,23.5 57.47,18.41 57.47,17.14 72.71,11.75 57.47,14.61 57.47,15.88 66.36,13.02 65.09,13.02 63.82,13.02 62.55,13.02 61.28,13.02 60.01,13.02 58.74,13.02 57.47,13.34 72.71,13.02 72.71,10.48 70.17,13.02 70.17,10.48 70.17,11.75 70.17,9.21 70.17,6.67 72.71,9.21 72.71,6.67 72.71,7.94 73.98,23.81 73.98,18.73 73.98,20 73.98,21.27 73.98,22.54 73.98,17.46 73.98,16.19 73.98,13.65 73.98,14.92 67.63,28.89 57.47,26.04 57.47,27.3 66.36,28.89 65.09,28.89 72.71,28.89 71.44,28.89 70.17,28.89 68.9,28.89 73.98,28.89 73.98,25.08 73.98,26.35 73.98,27.62 70.17,5.4 72.71,5.4 7.62,35.88 55.24,15.56 41.59,41.27 60.64,7.62 25.08,26.04 63.18,40.32 43.18,45.4 53.98,57.47 88.27,45.4
  pour Bottom: 80.96,91.44 96.84,91.44 96.84,63.5 80.96,63.5
  pour Top: 80.96,91.44 96.84,91.44 96.84,63.5 80.96,63.5
  pour Top: 110.49,0 80.96,0 80.96,62.87 110.49,62.87
  pour Bottom: 110.49,0 80.96,0 80.96,62.87 110.49,62.87
  pour Bottom (isolate 0.254, rank 2): 0,0 0,54.29 33.02,54.29 33.02,49.21 47.15,49.21 47.15,54.29 80.33,54.29 80.33,0
  pour Top (isolate 0.254, rank 2): 0,0 0,54.29 33.02,54.29 33.02,49.21 47.15,49.21 47.15,54.29 80.33,54.29 80.33,0
  pour Top (isolate 0.254, rank 2): 0,54.93 0,97.47 76.99,97.47 76.99,54.93
  pour Bottom (isolate 0.254, rank 2): 0,54.93 0,97.47 76.99,97.47 76.99,54.93
LCD_CS  (via drill 0.6)  (1 unrouted)
  Top 0.254: U1.26 46.21,31.89 v46.35,31.75 | v42.23,56.83 40.96,55.56 26.04,55.56 17.14,64.45 JP2.3
  Bottom 0.254: v46.35,31.75 47.31,30.8 47.31,26.67 46.99,26.35 45.72,26.35 44.13,27.94 41.59,27.94 41.27,27.62 14.1,27.62 U$4.TFT_CS | U$16.13 43.33,57.94 v42.23,56.83
LCD_DC  (via drill 0.6)  (1 unrouted)
  Top 0.254: U1.12 46.71,26.95 v46.35,27.3 | v40.64,58.42 39.69,57.47 27.94,57.47 15.88,69.53 JP2.5
  Bottom 0.254: v46.35,27.3 45.72,27.3 44.45,28.57 38.73,28.57 37.78,29.53 10.93,29.53 U$4.TFT_DC | U$16.15 41.93,59.71 v40.64,58.42
MASTER-RESET  (via drill 0.6)  (1 unrouted)
  Top 0.254: v42.23,58.42 40.32,56.52 26.99,56.52 16.51,66.99 JP2.4 | v38.1,24.77 39.69,24.77 41.27,26.35 41.27,29.84 40.75,30.37 U1.40 38.53,30.37 37.47,31.43 R2.1 C20.1 32.8,32.8 31.75,31.75 v31.75,28.57
  Bottom 0.254: U$16.14 42.63,58.83 v42.23,58.42 | U$4.TFT_RESET 12.51,28.57 v31.75,28.57 | v38.1,24.77 36.51,24.77 JTAG.10
MCP1_INT  (via drill 0.6)
  Top 0.254: v57.47,28.57 52.39,23.5 46.73,23.5 46.21,24.01 U1.11
  Bottom 0.254: IC1.20 52.73,37.44 53.02,37.15 56.52,37.15 57.15,37.78 58.42,37.78 59.05,37.15 59.05,35.56 58.74,35.24 58.74,29.84 v57.47,28.57
MISO  (via drill 0.6)  (1 unrouted)
  Top 0.254: v45.4,30.8 46.35,30.8 46.78,30.37 U1.21 51.7,30.37 54.98,33.66 64.14,33.66 64.8,32.99 U3.4
  Bottom 0.254: v45.4,30.8 40.32,30.8 38.77,32.35 U$4.TFT_SDO(MISO)
MOSI  (via drill 0.6)  (1 unrouted)
  Top 0.254: v45.4,28.89 46.35,28.89 46.83,29.37 U1.19 52.55,29.37 55.56,32.38 62.87,32.38 v63.5,31.75 | J1.3 65.04,39.1 v64.77,39.37 | v37.47,58.42 28.89,58.42 15.24,72.07 JP2.6
  Bottom 0.254: v45.4,28.89 45.09,29.21 39.37,29.21 38.1,30.48 9.34,30.48 U$4.TFT_SDI(MOSI) | v64.77,39.37 64.77,33.02 v63.5,31.75 | U$16.19 39.13,60.09 v37.47,58.42
N$1
  Top 0.254: U1.43 37.17,28.87 36.73,29.31 C2.1
N$2
  Top 0.254: U1.1 40.9,24.87 39.09,23.07 U$1.2 39.05,22.18 39.05,19.79 C3.1
N$3
  Top 0.254: U1.2 41.71,22.34 U$1.1 41.59,20.22 C4.1
N$4
  Bottom 0.254: RN5.4 RN6.5 54.86,12.63 56.52,14.29 56.52,15.88 55.56,16.83 49.21,16.83 47.92,15.53 U8.3
N$5
  Bottom 0.254: LED4.C 13.49,47.62 28.57,47.62 29.21,46.99 47.31,46.99 47.53,46.77 IC1.1
N$6  (via drill 0.6)
  Top 0.254: v74.61,36.2 LED5.C
  Bottom 0.254: v74.61,36.2 64.17,46.64 IC5.1
N$7
  Bottom 0.254: LED3.C 32.22,47.62 47.62,47.62 48.18,47.07 IC1.2
N$8  (via drill 0.6)
  Top 0.254: LED5.A v74.61,39.69
  Bottom 0.254: R12.1 73.24,39.69 v74.61,39.69
N$10
  Top 0.406: L6.1 10.85,6.99 D5.A
N$11
  Top 0.254: L2.1 69.51,8.47 C10.2 R11.2
N$12
  Bottom 0.254: IC5.5 61.59,49.84 61.91,50.16 R14.1
N$13
  Top 0.254: J1.7 69.44,37.24 70.48,36.2 U3.2
N$14
  Top 0.254: P2_1.1 U$2.NC@5
N$15
  Top 0.254: U$2.RESETB 45.4,39.46 36.28,48.58 RST.1
N$18
  Top 0.254: U$2.NC@6 37.23,39.46 38.73,40.96 38.73,44.45 35.24,47.94 32.07,47.94 30.8,46.67 P2_2.1
N$19
  Top 0.254: U$3.9 69.34,13.68 68.26,12.6 R11.1
N$20
  Top 0.813: 71.54,7.94 71.54,2.41 X1.P | L2.2 71.54,7.94 | U$3.11 71.54,7.94
N$21
  Bottom 0.254: RN5.3 RN6.6 54.06,12.94 53.66,13.34 52.07,13.34 51.44,13.97 51.44,15.24 50.8,15.88 49.53,15.88 49.24,15.58 U8.5
N$22
  Bottom 0.254: LED2.C 49.53,47.94 48.83,47.24 IC1.3
N$23
  Bottom 0.254: IC1.4 49.48,46.94 52.07,49.53 54.61,49.53 56.83,51.75 65.56,51.75 LED1.C
N$24
  Bottom 0.254: RN7.1 45.65,15.31 46.29,14.67 U8.1 U8.2
N$25
  Bottom 0.254: RN7.2 44.85,12.62 45.4,12.06 46.99,12.06 47.31,12.06 49.21,12.06 49.87,12.72 U8.6 U8.7
N$26
  Bottom 0.254: RN7.3 44.05,12.15 45.09,11.11 49.21,11.11 49.87,10.45 U8.9 U8.8
N$27
  Bottom 0.254: RN7.4 43.25,11.04 45.47,8.83 U8.14 U8.13
N$28
  Bottom 0.254: RN6.7 RN5.2 53.26,10.56 53.66,10.16 60.64,10.16 61.91,8.89 61.91,6.99 60.64,5.71 49.85,5.71 47.92,7.64 U8.12
N$29  (via drill 0.6)
  Top 0.254: RN1.4 54.36,50.09 v53.98,50.48
  Bottom 0.254: v53.98,50.48 48.58,50.48 46.35,48.26 33.97,48.26 31.43,50.8 27.94,50.8 25.68,48.55 14.95,48.55 12.06,51.43 LED4.A
N$30  (via drill 0.6)
  Top 0.254: RN1.3 55.16,50.88 v54.61,51.44
  Bottom 0.254: LED3.A 34.45,48.9 46.04,48.9 48.26,51.12 51.75,51.12 52.07,51.44 v54.61,51.44
N$31
  Bottom 0.254: RN6.8 RN5.1 51.44,10.04 51.44,8.26 50.8,7.62 49.53,7.62 49.24,7.91 U8.10
N$32  (via drill 0.6)
  Top 0.254: RN1.2 55.96,51.67 v55.24,52.39
  Bottom 0.254: v55.24,52.39 49.69,52.39 LED2.A
N$33  (via drill 0.6)
  Top 0.254: RN1.1 56.76,52.46 v56.52,52.7
  Bottom 0.254: LED1.A 68.11,52.7 v56.52,52.7
N$34
  Bottom 0.254: IC1.18 54.03,39.74 54.4,40.11 R8.1
N$35  (via drill 0.6)
  Top 0.254: U$18.P$25 88.27,56.83 89.53,55.56 90.96,55.56 92.23,54.29 94.61,54.29 v95.89,53.02
  Bottom 0.254: IC6.28 97.69,45.18 95.57,47.31 95.57,51.12 95.89,51.44 v95.89,53.02
N$36
  Bottom 0.254: RN2.3 35.16,15.2 34.28,14.31 U12.6
N$37  (via drill 0.6)
  Top 0.254: v55.88,21.59 55.88,17.46 50.16,11.75 50.16,5.4 52.07,3.49 v58.1,3.49
  Bottom 0.254: v58.1,3.49 U$5.P$2 | RN3.4 55.65,20.73 55.88,20.95 v55.88,21.59 55.88,23.5 55.65,23.72 RN4.5
N$38  (via drill 0.6)
  Top 0.254: v54.93,22.54 54.93,17.46 47.31,9.84 v47.31,5.71
  Bottom 0.254: v47.31,5.71 47.31,3.67 U$6.P$2 | RN3.3 54.93,20.03 v54.93,22.54 54.93,24.42 RN4.6
N$39  (via drill 0.6)
  Top 0.254: U$18.P$17 88.27,42.86 89.53,41.59 90.96,41.59 92.23,40.32 v95.89,40.32
  Bottom 0.254: v95.89,40.32 97.79,40.32 98.99,41.52 IC6.26
N$40  (via drill 0.6)
  Top 0.254: U$18.P$9 85.25,30.48 v95.89,30.48
  Bottom 0.254: v95.89,30.48 96.84,31.43 96.84,35.56 100.29,39.02 IC6.24
N$41
  Bottom 0.254: R50.2 33.34,11.71 U12.1
N$42
  Bottom 0.254: R49.2 31.45,10.39 U12.3
N$43
  Bottom 0.254: U13.3 37.8,10.07 R51.2 R53.2
N$44
  Bottom 0.254: U13.1 39.67,10.39 R54.2 R52.2
N$45
  Bottom 0.254: U13.6 39.67,15.57 39,16.25 RN2.1
N$46
  Bottom 0.254: RN2.2 35.96,15.2 36.84,14.31 U13.4
N$48  (1 unrouted)
  Bottom 0.254: R24.1 2.54,33.66 1.91,33.02 1.91,31.49 U$4.TFT_LED
N$49
  Bottom 0.254: U12.4 31.45,15.57 32.12,16.25 RN2.4
N$50  (via drill 0.6)
  Top 0.254: v53.02,22.54 53.02,17.46 44.77,9.21 v44.77,6.99
  Bottom 0.254: U$8.P$2 30.48,3.49 32.7,5.71 43.5,5.71 v44.77,6.99 | RN3.1 53.25,20.73 53.02,20.95 v53.02,22.54 53.02,23.5 53.25,23.72 RN4.8
N$51  (via drill 0.6)
  Top 0.254: v53.98,21.59 53.98,17.46 46.04,9.53 v46.04,6.35
  Bottom 0.254: U$7.P$2 43.18,3.49 v46.04,6.35 | RN3.2 53.98,20.03 v53.98,21.59 53.98,24.42 RN4.7
N$52  (via drill 0.6)
  Top 0.254: U$18.P$1 85.25,16.51 v95.89,16.51
  Bottom 0.254: v95.89,16.51 97.16,17.78 97.16,28.26 98.11,29.21 98.11,34.29 101.59,37.77 IC6.22
N$53
  Bottom 0.254: U$18.P$33 98.11,11.27 98.11,27.62 98.74,28.26 98.74,33.66 102.24,37.16 IC6.21
N$54  (via drill 0.6)
  Top 0.254: U$18.P$41 v95.89,20
  Bottom 0.254: v95.89,20 95.89,28.57 97.47,30.16 97.47,34.92 100.94,38.4 IC6.23
N$55  (via drill 0.6)
  Top 0.254: U$18.P$49 v95.89,33.97
  Bottom 0.254: v95.89,33.97 95.89,35.88 99.64,39.63 IC6.25
N$56  (via drill 0.6)
  Top 0.254: U$18.P$57 v96.52,47.94
  Bottom 0.254: IC6.27 98.34,46.12 v96.52,47.94
N$57
  Bottom 0.254: IC6.18 104.19,42.28 103.61,41.7 R9.1
N$58  (via drill 0.6)
  Top 0.254: v53.66,40.64 54.27,40.03 U14.2
  Bottom 0.254: IC1.21 52.08,39.7 53.02,40.64 v53.66,40.64
N$59  (via drill 0.6)
  Top 0.254: v54.93,41.27 55.56,40.64 U14.4
  Bottom 0.254: IC1.22 51.43,40 53.02,41.59 54.61,41.59 v54.93,41.27
N$60
  Bottom 0.254: U$16.26 34.23,60.38 35.56,59.05 R1.2
N$61
  Bottom 0.254: U$16.2 51.03,60.41 52.23,59.21 C55.1
N$62
  Bottom 0.254: U$16.3 50.33,60.16 51.12,59.37 51.12,57.15 51.65,56.62 C55.2
N$63
  Bottom 0.254: U$16.4 49.63,59.59 50.01,59.21 C37.1
N$64
  Bottom 0.254: C37.2 49.43,56.62 48.93,57.11 U$16.5
N$65
  Bottom 0.254: U$16.28 32.83,60.45 31.43,59.05 C33.1
N$66
  Bottom 0.254: U$16.27 33.53,58.35 C53.1
N$67  (via drill 0.6)
  Top 0.254: U14.6 56.86,41.25 v56.2,41.91
  Bottom 0.254: IC1.23 50.78,40.3 53.02,42.55 55.56,42.55 v56.2,41.91
N$68  (via drill 0.6)
  Top 0.254: U14.8 57.52,43.87 57.15,43.5 52.7,43.5 v51.44,42.23
  Bottom 0.254: v51.44,42.23 50.13,40.92 IC1.24
N$69  (via drill 0.6)
  Top 0.254: v57.47,36.2 58.42,37.15 58.42,46.04 58.1,46.35 57.15,46.35 56.86,46.06 U14.9
  Bottom 0.254: v57.47,36.2 57.47,31.85 C51.1 55.65,29.86 RN4.4
N$70  (via drill 0.6)
  Top 0.254: U14.5 56.22,37.81 55.56,37.15 v55.56,36.2
  Bottom 0.254: v55.56,36.2 C56.1 54.61,33.87 54.61,28.57 54.85,28.33 RN4.3
N$71  (via drill 0.6)
  Top 0.254: U14.3 54.9,37.12 v53.98,36.2 53.02,35.24 51.75,35.24 49.53,37.47 C57.1
  Bottom 0.254: RN4.2 54.05,28.33 53.98,28.41 v53.98,36.2
N$72  (via drill 0.6)
  Top 0.254: U14.1 53.61,37.41 v52.39,36.2 51.75,36.83 C58.1
  Bottom 0.254: v52.39,36.2 53.25,35.33 RN4.1
RPM_IN  (via drill 0.6)
  Top 0.254: U$9.4 35.18,7.87 34.29,6.99 v31.43,6.99
  Bottom 0.254: v31.43,6.99 31.11,7.3 R49.1
RX_GPS
  Top 0.254: U1.16 50.86,27.87 51.56,27.16 53.27,27.16 56.58,30.48 61.76,30.48 63.04,29.2 U$3.20
SCK  (via drill 0.6)  (1 unrouted)
  Top 0.254: v46.04,29.84 46.06,29.87 U1.20 52.09,29.87 55.24,33.02 63.5,33.02 v65.09,31.43 | J1.5 67.24,39.3 v67.31,39.37 | v39.05,58.42 38.1,59.37 29.84,59.37 14.61,74.61 JP2.7
  Bottom 0.254: v46.04,29.84 40.01,29.84 38.42,31.43 7.75,31.43 U$4.TFT_SCK | v67.31,39.37 67.31,33.66 v65.09,31.43 | U$16.18 39.83,59.2 v39.05,58.42
SCL_3V3  (via drill 0.6)
  Top 0.254: U1.32 43.21,32.1 v42.86,31.75 42.86,27.3 v42.23,26.67 | v50.48,43.81 50.48,46.67 50.8,46.99 50.8,49.53 | R22.2 50.8,50.59 50.8,49.53 | 50.8,49.53 IC3.1
  Bottom 0.254: v42.23,26.67 28.89,26.67 27.3,25.08 27.3,18.73 27.94,18.1 27.94,14.61 24.13,10.79 22.86,10.79 22.23,11.43 U9.7 | v42.86,31.75 45.09,33.97 45.09,42.23 46.67,43.81 v50.48,43.81 50.8,44.13 54.29,44.13 54.68,44.52 IC1.12
SCL_BUFFERED  (via drill 0.6)  (2 unrouted)
  Top 0.254: v21.27,10.48 23.18,10.48 26.07,13.37 RJ45_MAIN_BOARD.P$4 | 97.79,49.21 97.79,53.02 93.98,56.83 U$18.P$64 | 97.79,49.21 97.79,42.86 | 97.79,42.86 97.79,35.24 | 97.79,35.24 97.79,28.89 | 97.79,28.89 97.79,23.81 | v101.6,23.81 97.79,23.81 | 97.79,28.89 U$18.P$48 | U$18.P$56 97.79,42.86 | 97.79,23.81 97.79,21.27 | 97.79,21.27 97.79,14.92 | U$18.P$40 97.79,14.92 | U$18.P$32 90.96,47.94 92.23,49.21 97.79,49.21 | U$18.P$24 90.96,33.97 92.23,35.24 97.79,35.24 | U$18.P$16 90.96,20 92.23,21.27 97.79,21.27 | U$18.P$8 90.96,6.03 92.23,7.3 93.66,7.3 97.79,11.43 97.79,14.92
  Bottom 0.254: U9.5 U9.6 20.95,10.79 v21.27,10.48 | U10.6 U10.5 91.36,73.98 92.71,75.32 PAD6.1 | RJ45_MAIN_BOARD.P$4 26.06,17.34 25.3,18.1 R16.2 | U5.6 U5.5 101.6,25.01 v101.6,23.81
SCL_MCP
  Bottom 0.254: IC6.12 104.84,47.56 107,45.4 107,35.24 104.78,33.02 104.78,30.16 103.19,28.57 103.19,27.62 | 103.19,27.62 103.19,22.64 102.45,21.91 R13.2 | U5.7 103.19,27.62
SCL_MLX_SENSOR
  Bottom 0.254: MLX90614.P$1 88.9,85.41 93.24,81.06 R17.2 94.61,72.71 92.71,70.8 U10.7
SDA_3V3  (via drill 0.6)
  Top 0.254: v43.81,26.99 44.13,27.3 v44.13,31.75 43.71,32.17 U1.31 | v48.9,42.55 48.9,47.63 IC3.3 48.58,47.63 47.94,48.26 47.94,50.59 48.26,50.9 R21.2
  Bottom 0.254: v43.81,26.99 42.55,25.72 29.21,25.72 28.26,24.77 28.26,19.37 28.89,18.73 28.89,14.28 23.5,8.88 U9.1 | v44.13,31.75 46.04,33.66 46.04,41.59 46.99,42.55 v48.9,42.55 50.48,42.55 51.44,43.5 54.61,43.5 55.33,44.22 IC1.13
SDA_BUFFERED  (via drill 0.6)  (2 unrouted)
  Top 0.254: v105.09,16.83 105.09,14.92 94.93,4.76 85.57,4.76 84.3,6.03 | U$18.P$2 82.23,13.65 | 82.23,13.65 82.23,20 | 82.23,20 82.23,27.62 | 82.23,27.62 82.23,33.97 | 82.23,33.97 82.23,41.59 | 82.23,41.59 82.23,47.94 | 82.23,47.94 82.23,54.93 82.87,55.56 U$18.P$26 | U$18.P$18 82.23,41.59 | U$18.P$10 82.23,27.62 | U$18.P$58 85.57,49.21 84.3,47.94 82.23,47.94 | U$18.P$50 85.57,35.24 84.3,33.97 82.23,33.97 | U$18.P$42 85.57,21.27 84.3,20 82.23,20 | U$18.P$34 85.57,7.3 84.3,6.03 | 84.3,6.03 82.87,6.03 82.23,6.67 82.23,13.65
  Bottom 0.254: U9.2 U9.3 20.95,8.89 18.45,11.39 RJ45_MAIN_BOARD.P$3 18.45,19.41 18.73,19.68 R15.2 19.72,19.43 | PAD10.1 84.77,78.42 84.77,72.71 85.41,72.07 U10.3 U10.2 | U5.2 U5.3 105.41,26.35 105.09,26.04 v105.09,16.83
SDA_MCP
  Bottom 0.254: IC6.13 105.49,48.81 108.27,46.04 108.27,34.61 106.6,32.94 U5.1 105.09,28.89 104.14,27.94 104.14,20 102.87,18.73 R25.2
SDA_MLX_SENSOR
  Bottom 0.254: MLX90614.P$2 87.1,81.06 R18.2 83.19,71.44 85.09,69.53 U10.1
SQR_OPT_IN  (via drill 0.6)
  Top 0.254: U$9.3 37.72,7.87 v36.83,6.99
  Bottom 0.254: v36.83,6.99 33.97,6.99 33.34,7.62 R50.1
SW
  pour Top (no thermals): 21.59,21.59 21.59,23.5 18.73,26.35 15.24,26.35 15.24,25.72 14.61,25.08 11.43,25.08 11.43,23.81 18.41,23.81 19.05,23.18 19.05,21.59
SWCLK
  Top 0.254: JTAG.4 35.8,27.87 U1.45
SWDIO  (via drill 0.6)
  Top 0.254: U1.46 36.89,27.37 v34.29,24.77
  Bottom 0.254: v34.29,24.77 31.43,24.77 JTAG.2
THROTTLE_IN  (via drill 0.6)
  Top 0.254: U$15.3 54.23,7.68 53.85,7.3 v53.66,7.3
  Bottom 0.254: RN5.7 53.26,7.7 v53.66,7.3
TX_GPS
  Top 0.254: U1.15 50.4,27.37 51.37,26.39 53.7,26.39 56.83,29.53 61.28,29.53 61.94,28.86 U$3.21
USB_D+  (via drill 0.6)
  Top 0.254: U1.34 42.21,34.62 v41.59,35.24 | v18.1,43.81 17.36,44.55 U2.2 16.51,45.94 16.51,47.94 16.83,48.26 17.46,48.26 17.78,48.58 CN2.D+
  Bottom 0.254: v18.1,43.81 22.54,39.37 37.47,39.37 v41.59,35.24
USB_D-  (via drill 0.6)
  Top 0.254: U1.33 42.71,35.39 v41.59,36.51 | CN2.D- 18.42,46.13 U2.3 19.46,44.35 v20,43.81
  Bottom 0.254: v41.59,36.51 37.78,40.32 23.5,40.32 v20,43.81
USBVCC
  Top 0.406: R4.2 16.27,43 16.27,41.27 | 16.27,41.27 T1.1 | F1.1 25.63,46.54 C27.+ 25.63,41.82 25.08,41.27 16.27,41.27
VBAT  (via drill 0.6)
  Top 0.254: U$3.22 60.84,28.45 v60.96,28.57
  Bottom 0.254: 61.59,30.16 61.59,29.21 v60.96,28.57 | U$17.+ 74.61,30.16 61.59,30.16 | IC5.3 C6.2 61.59,43.08 61.59,30.16
VDDANA
  Top 0.254: C26.1 47.46,17.3 L1.2 45.55,17.95 44.77,18.73 44.13,18.73 43.6,19.27 C12.1 43.5,20.11 43.5,22.23 43.71,22.44 U1.6
VIN
  Top 0.406: IC2.5 10.48,21.45 10.76,21.17 | R7.1 6.08,39.95 6.08,18.41 PC1.+ 12.06,15.24 D5.C
  Top 0.508: 10.76,21.17 C41.+
  pour Top (no thermals): 11.43,22.54 9.84,22.54 8.89,21.59 5.71,21.59 5.71,16.83 9.53,16.83 11.43,18.73
VUSB
  Top 0.406: CN2.VBUS 19.06,48.56 19.46,48.16 U2.4 F1.2 22.18,49.48 22.54,49.85 C31.1

## Text on the board
tNames: SDA | GND | SCL | 3V3 | 5V | 5v > 1 > W & Orange / SDA > 2 > Orange / 3.3v > 4 > Blue / GND > 5 > W & Blue / 5v (PERM) > 6 > Green / SCL > 8 > Brown | DAWA 6.3 / Edouard PIGEON | I2C | DIGITAL IN | RPM | SQR1 | BRAKE | DIGI1 | ANALOG IN | GEAR | THROTTLE | ANA1/2
bNames: DAWA 6.3 / Edouard PIGEON | DAWA 6.3 / Edouard PIGEON